# Altium schematic sheet 24.064_HEAT.SchDoc
size A4
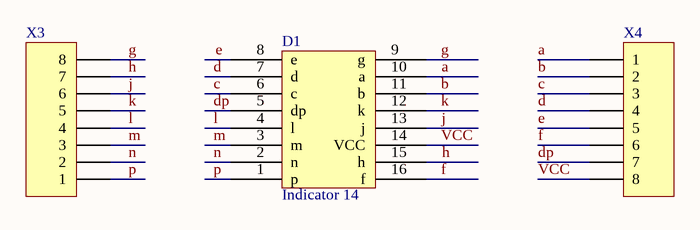
[diagram p0: 24.064_HEAT.SchDoc]

## Parts
D1  Indicator 14  [INDICATIR 14]
X3  Header 8  [HDR1X8]  (value not drawn)
X4  Header 8  [HDR1X8]  (value not drawn)

## Nets
a: D1.10(a) X4.1
b: D1.11(b) X4.2
c: D1.6(c) X4.3
d: D1.7(d) X4.4
dp: D1.5(dp) X4.7
e: D1.8(e) X4.5
f: D1.16(f) X4.6
g: D1.9(g) X3.8
h: D1.15(h) X3.7
j: D1.13(j) X3.6
k: D1.12(k) X3.5
l: D1.4(l) X3.4
m: D1.3(m) X3.3
n: D1.2(n) X3.2
p: D1.1(p) X3.1
VCC: D1.14(VCC) X4.8

## Library data of the parts
X3 X4 = Header 8: Header, 8-Pin; LatestRevisionDate: 17-Jul-2002; LatestRevisionNote: Re-released for DXP Platform.; Publisher: Altium Limited